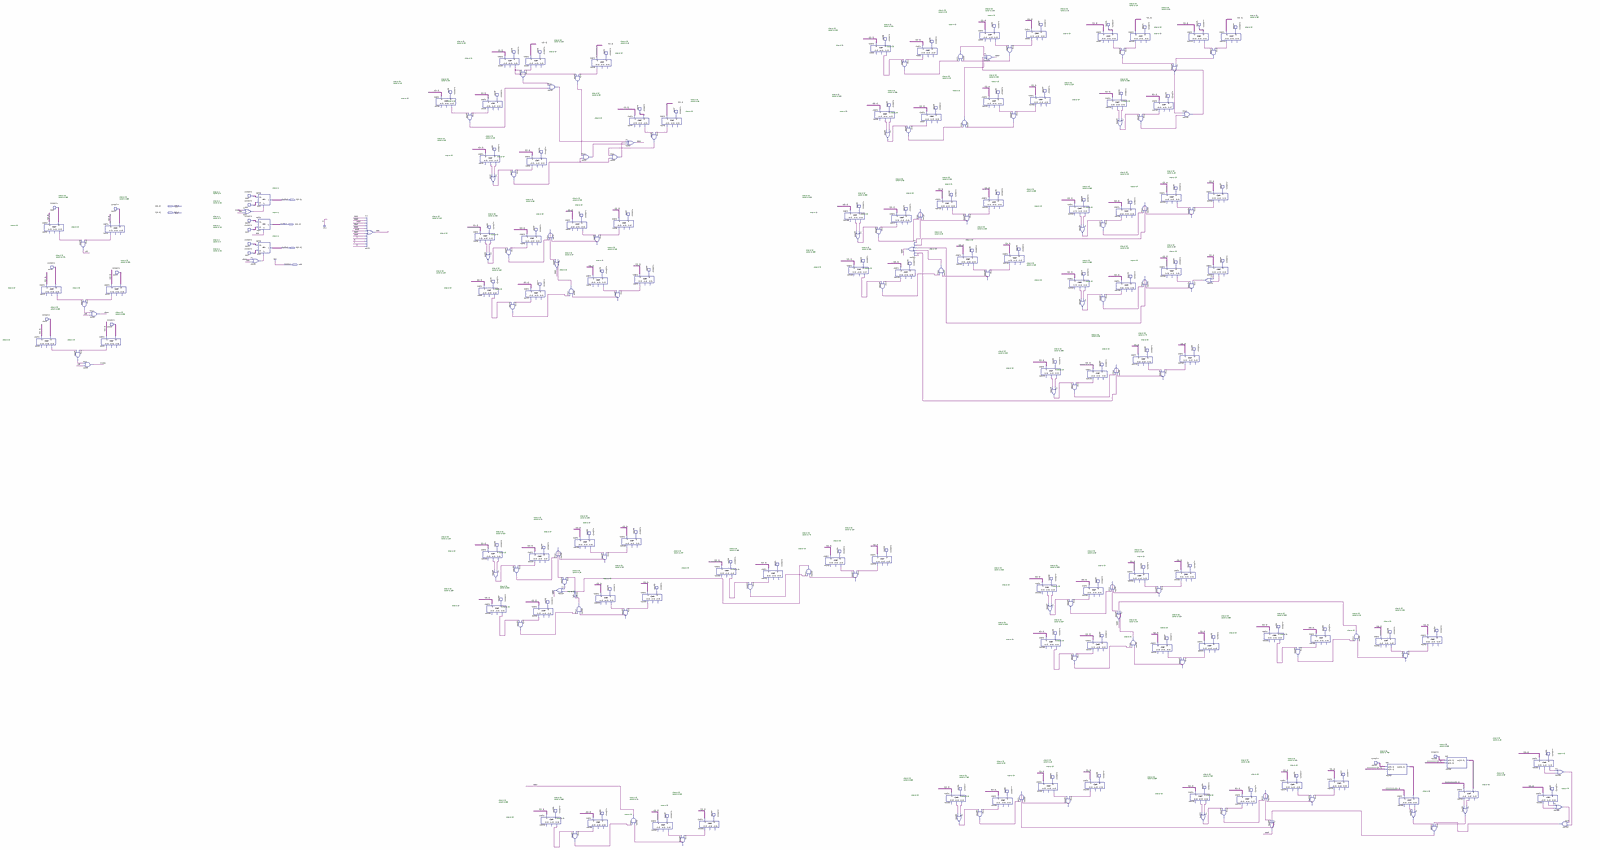
[diagram p0: schematic sheet, whole]
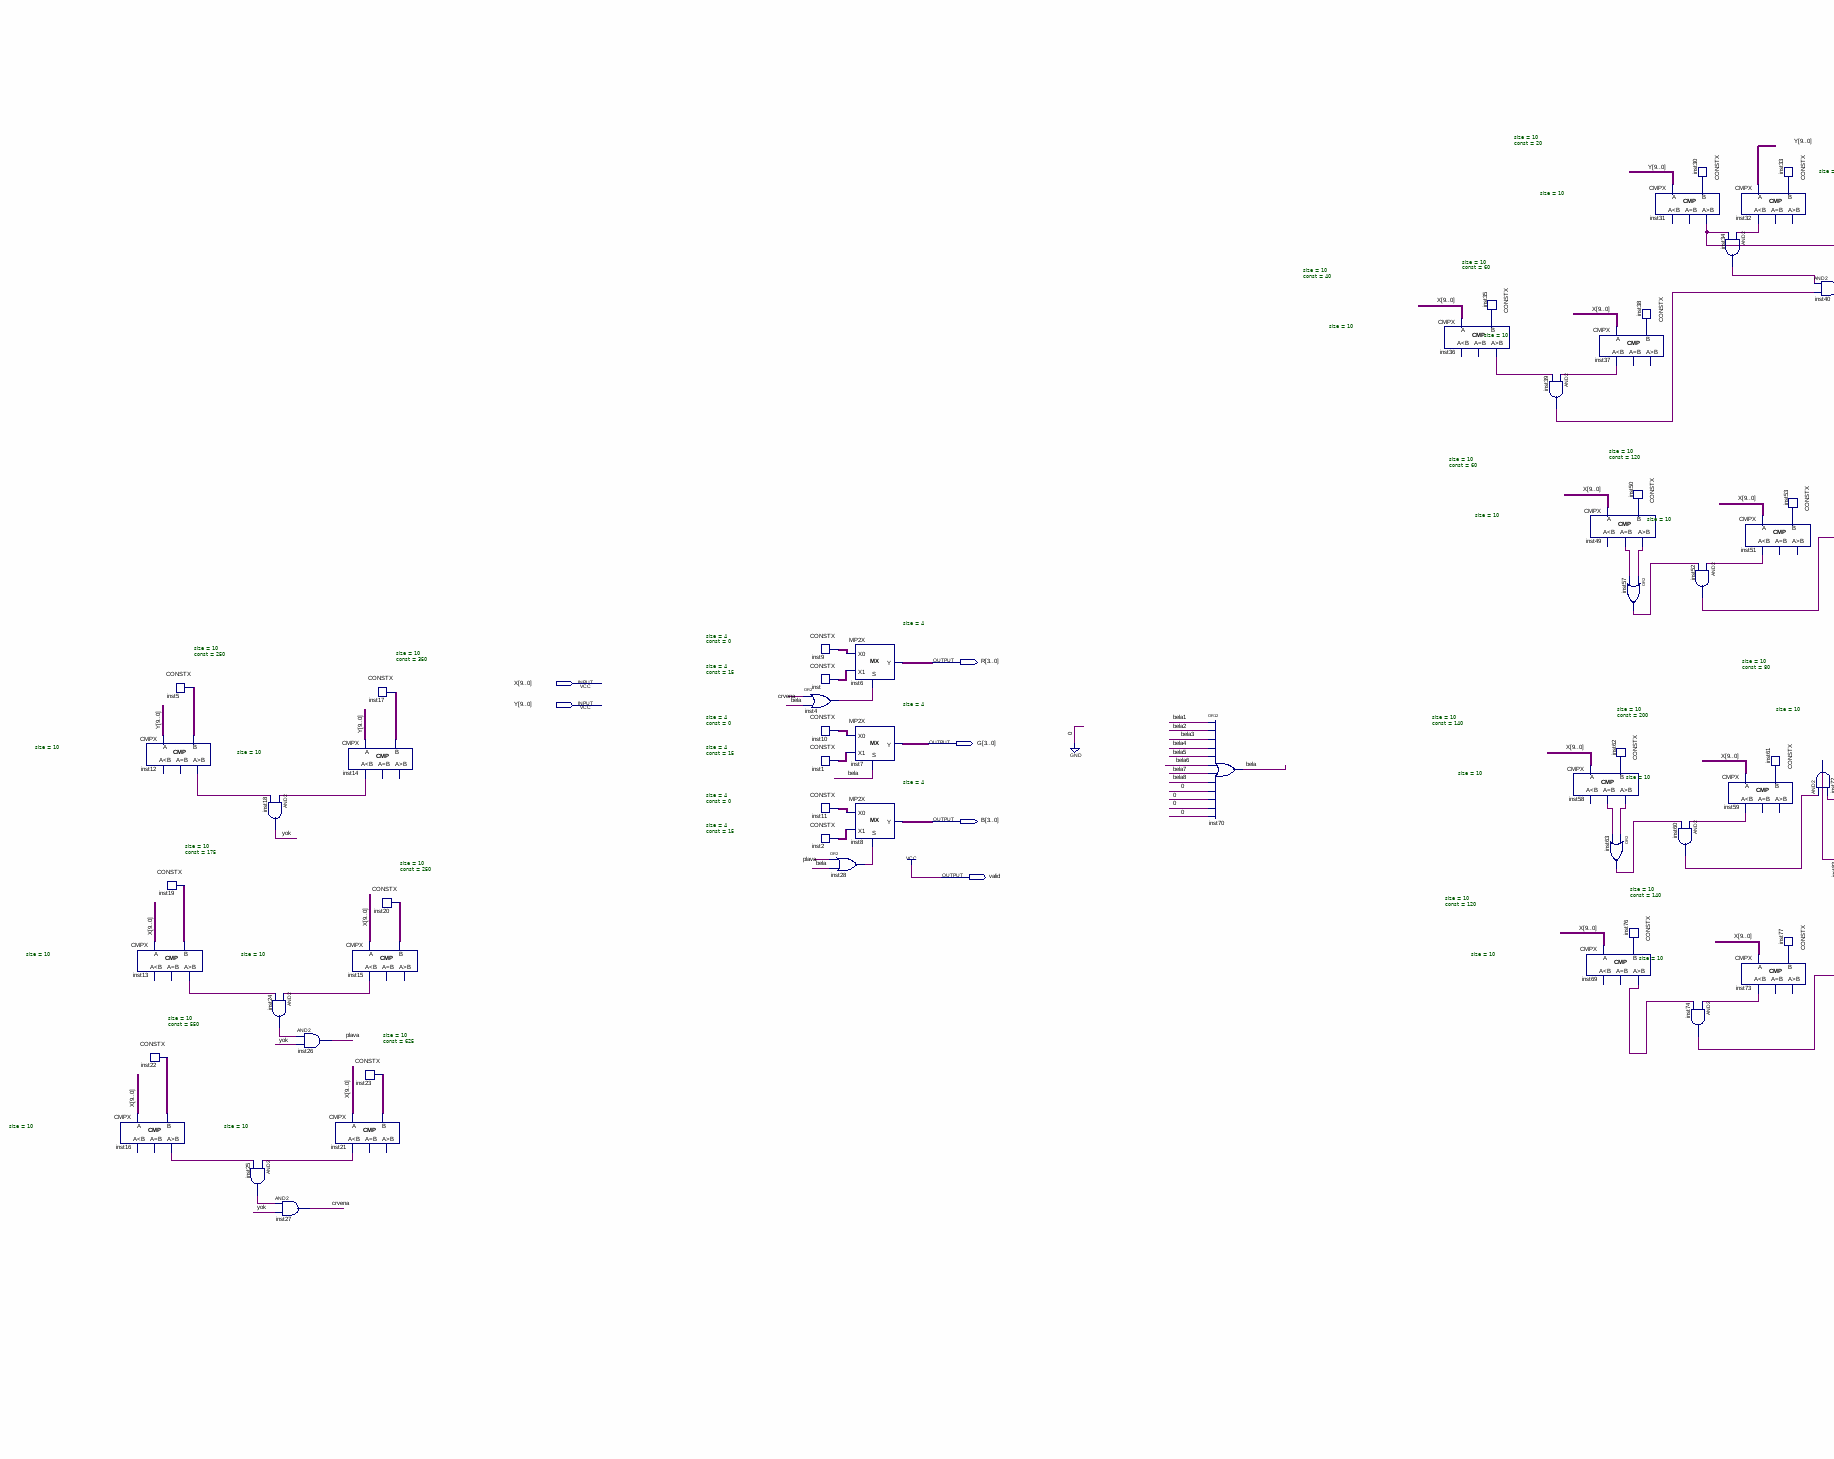
[diagram p1: schematic sheet, upper left part]
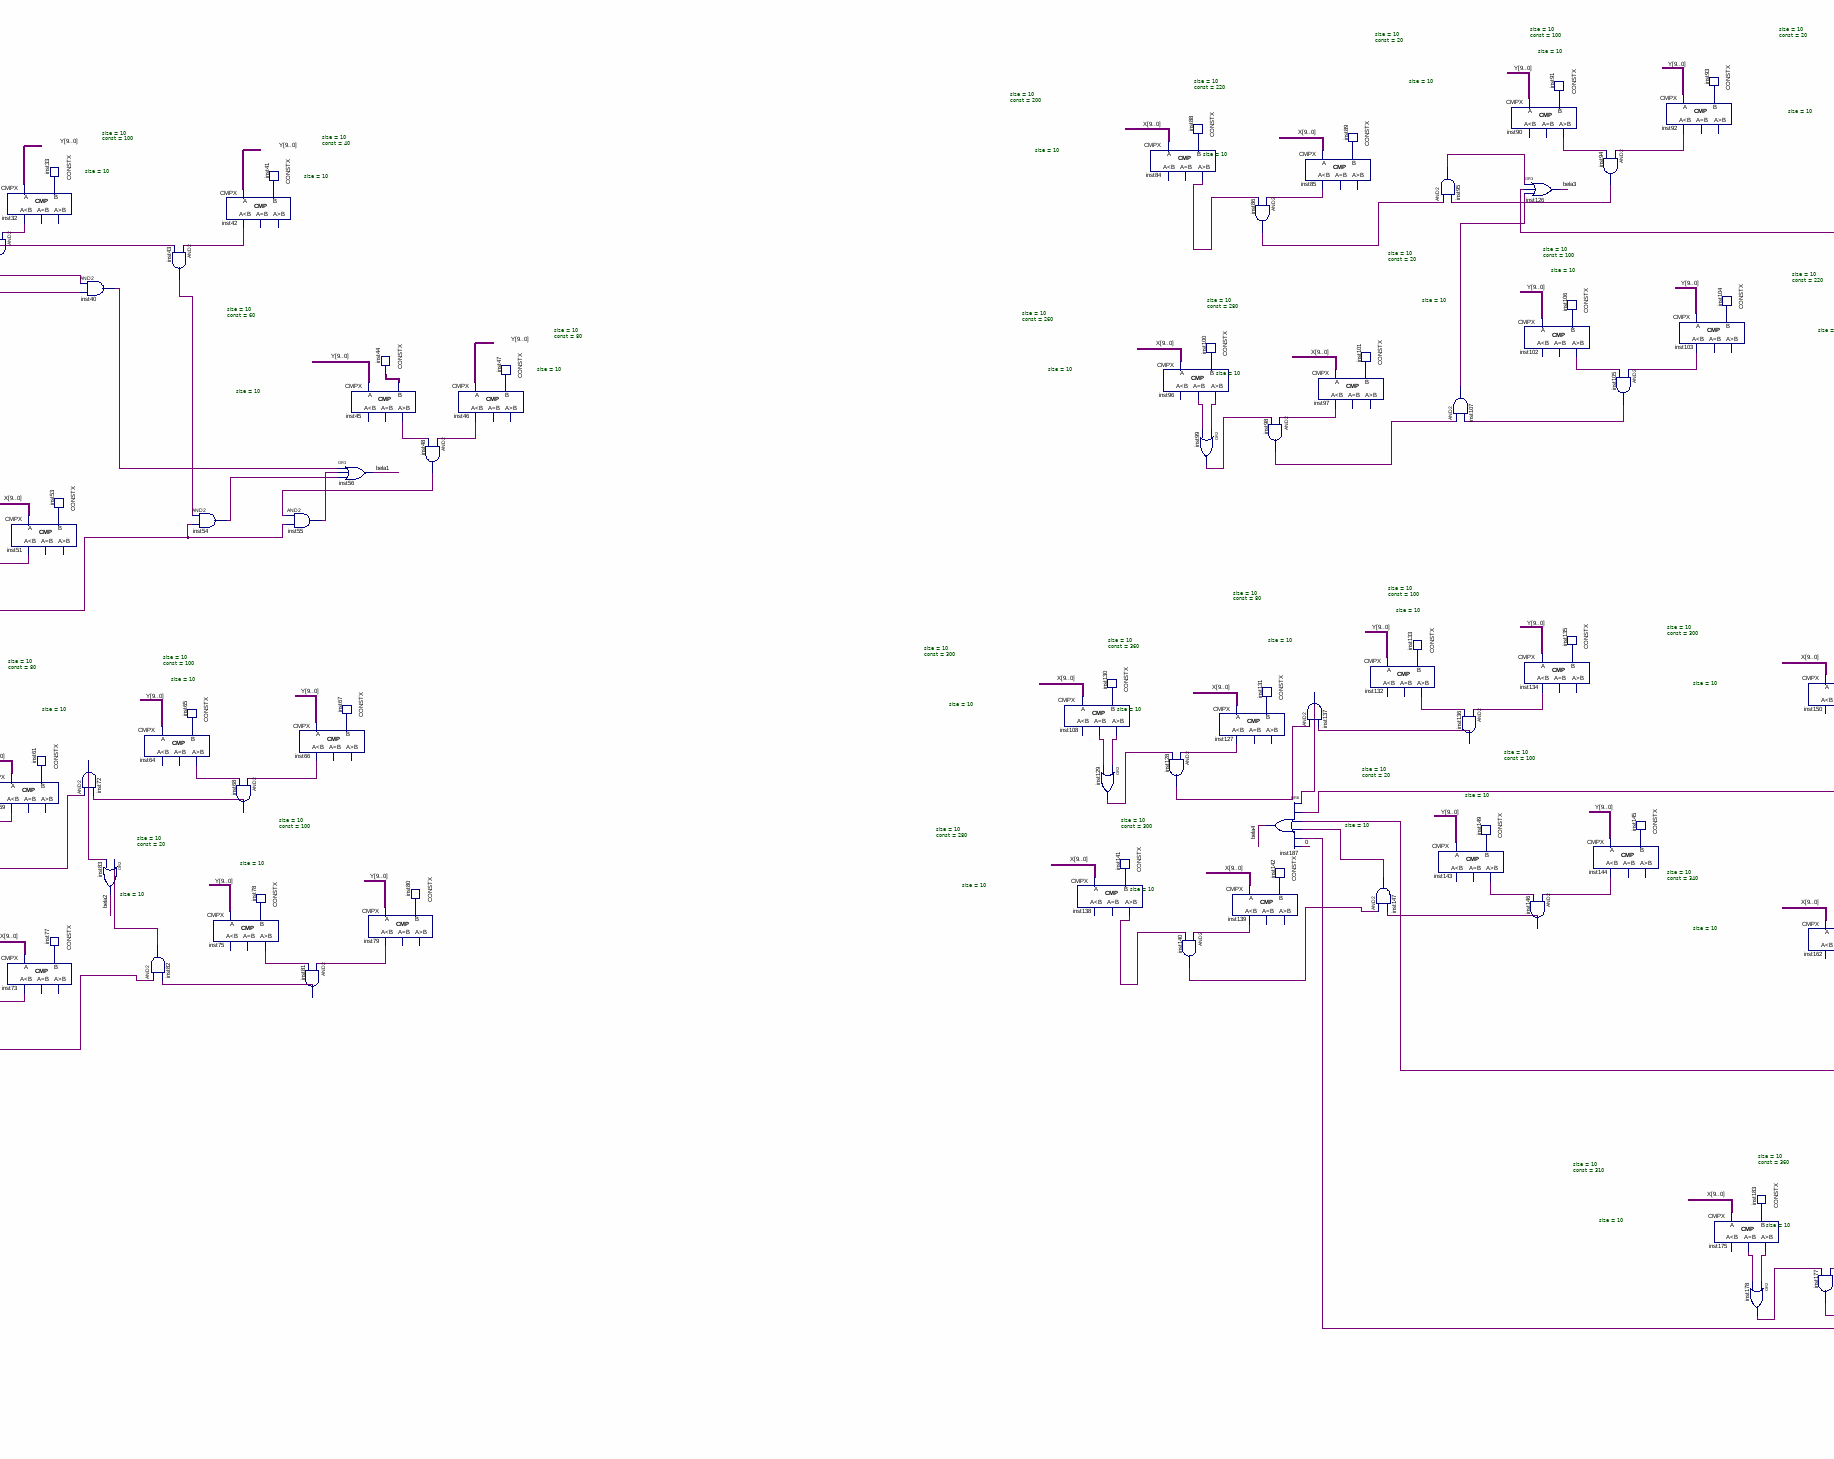
[diagram p2: schematic sheet, upper centre part]
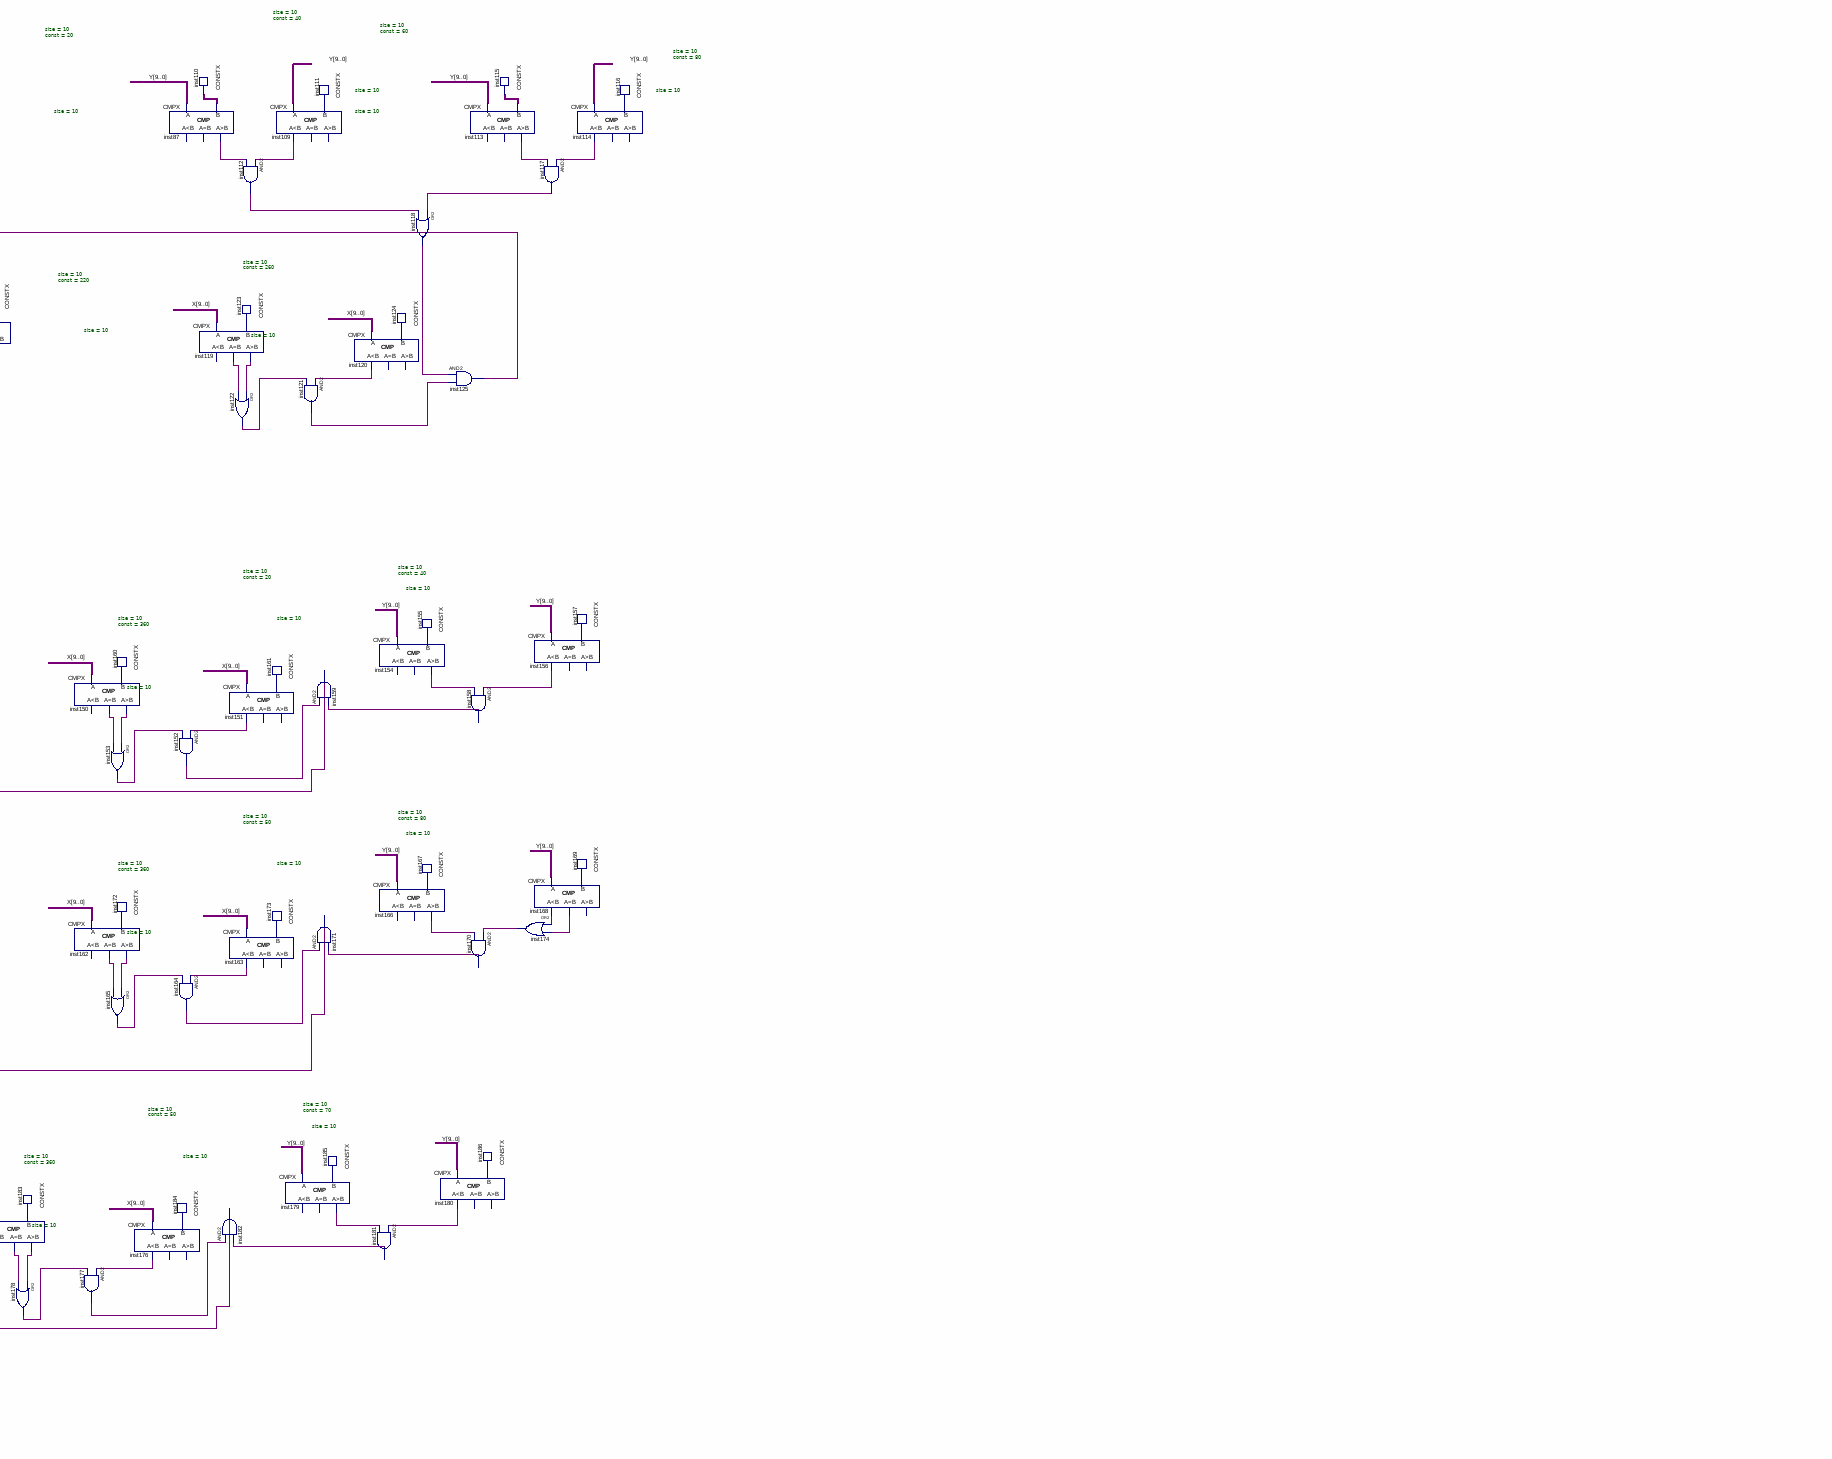
[diagram p3: schematic sheet, upper right part]
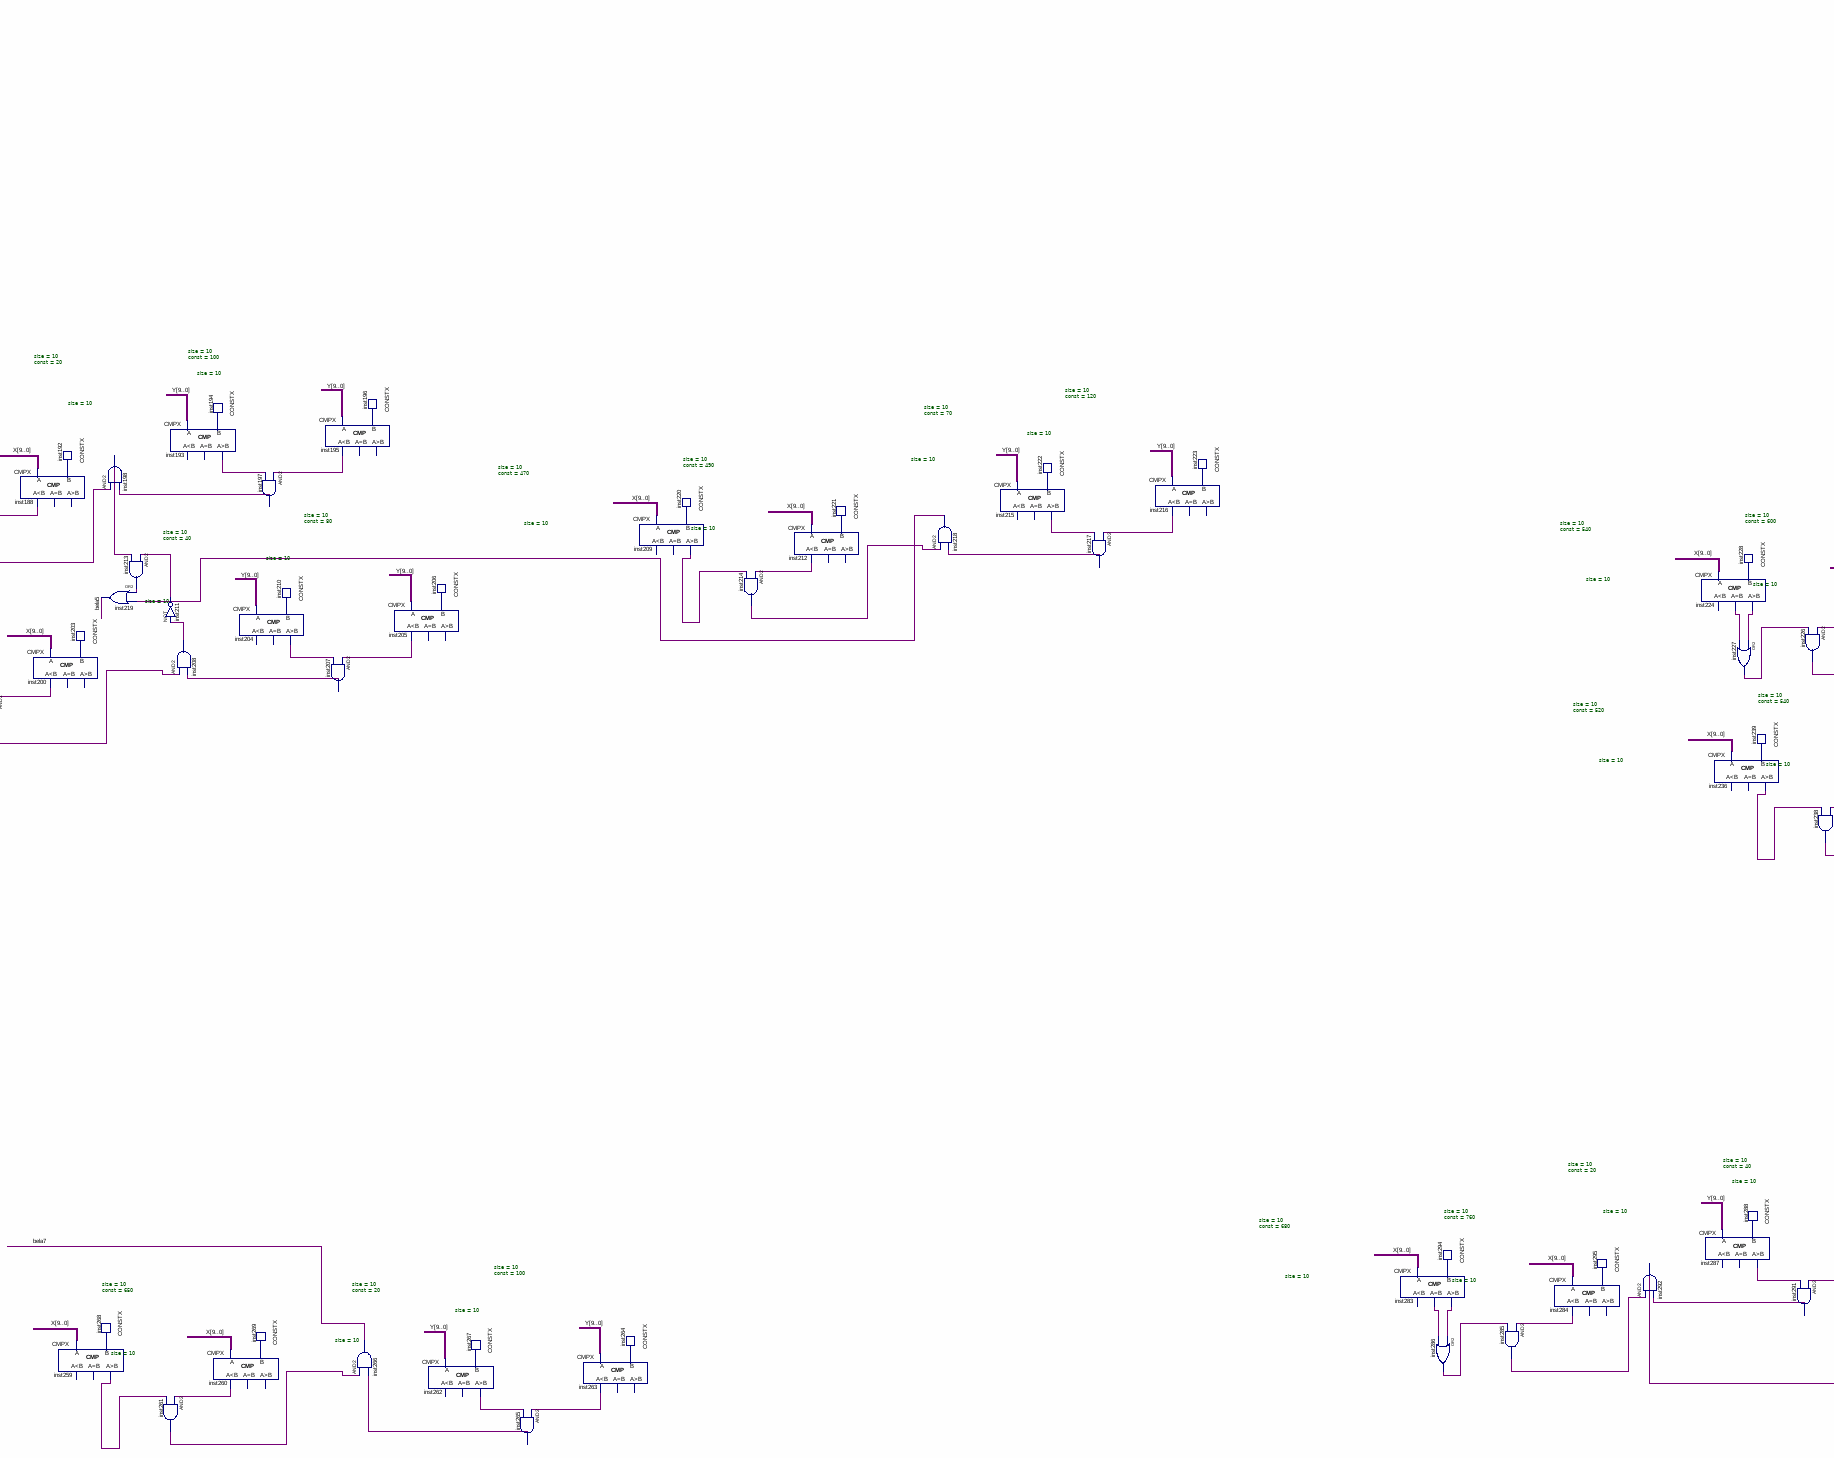
[diagram p4: schematic sheet, lower centre part]
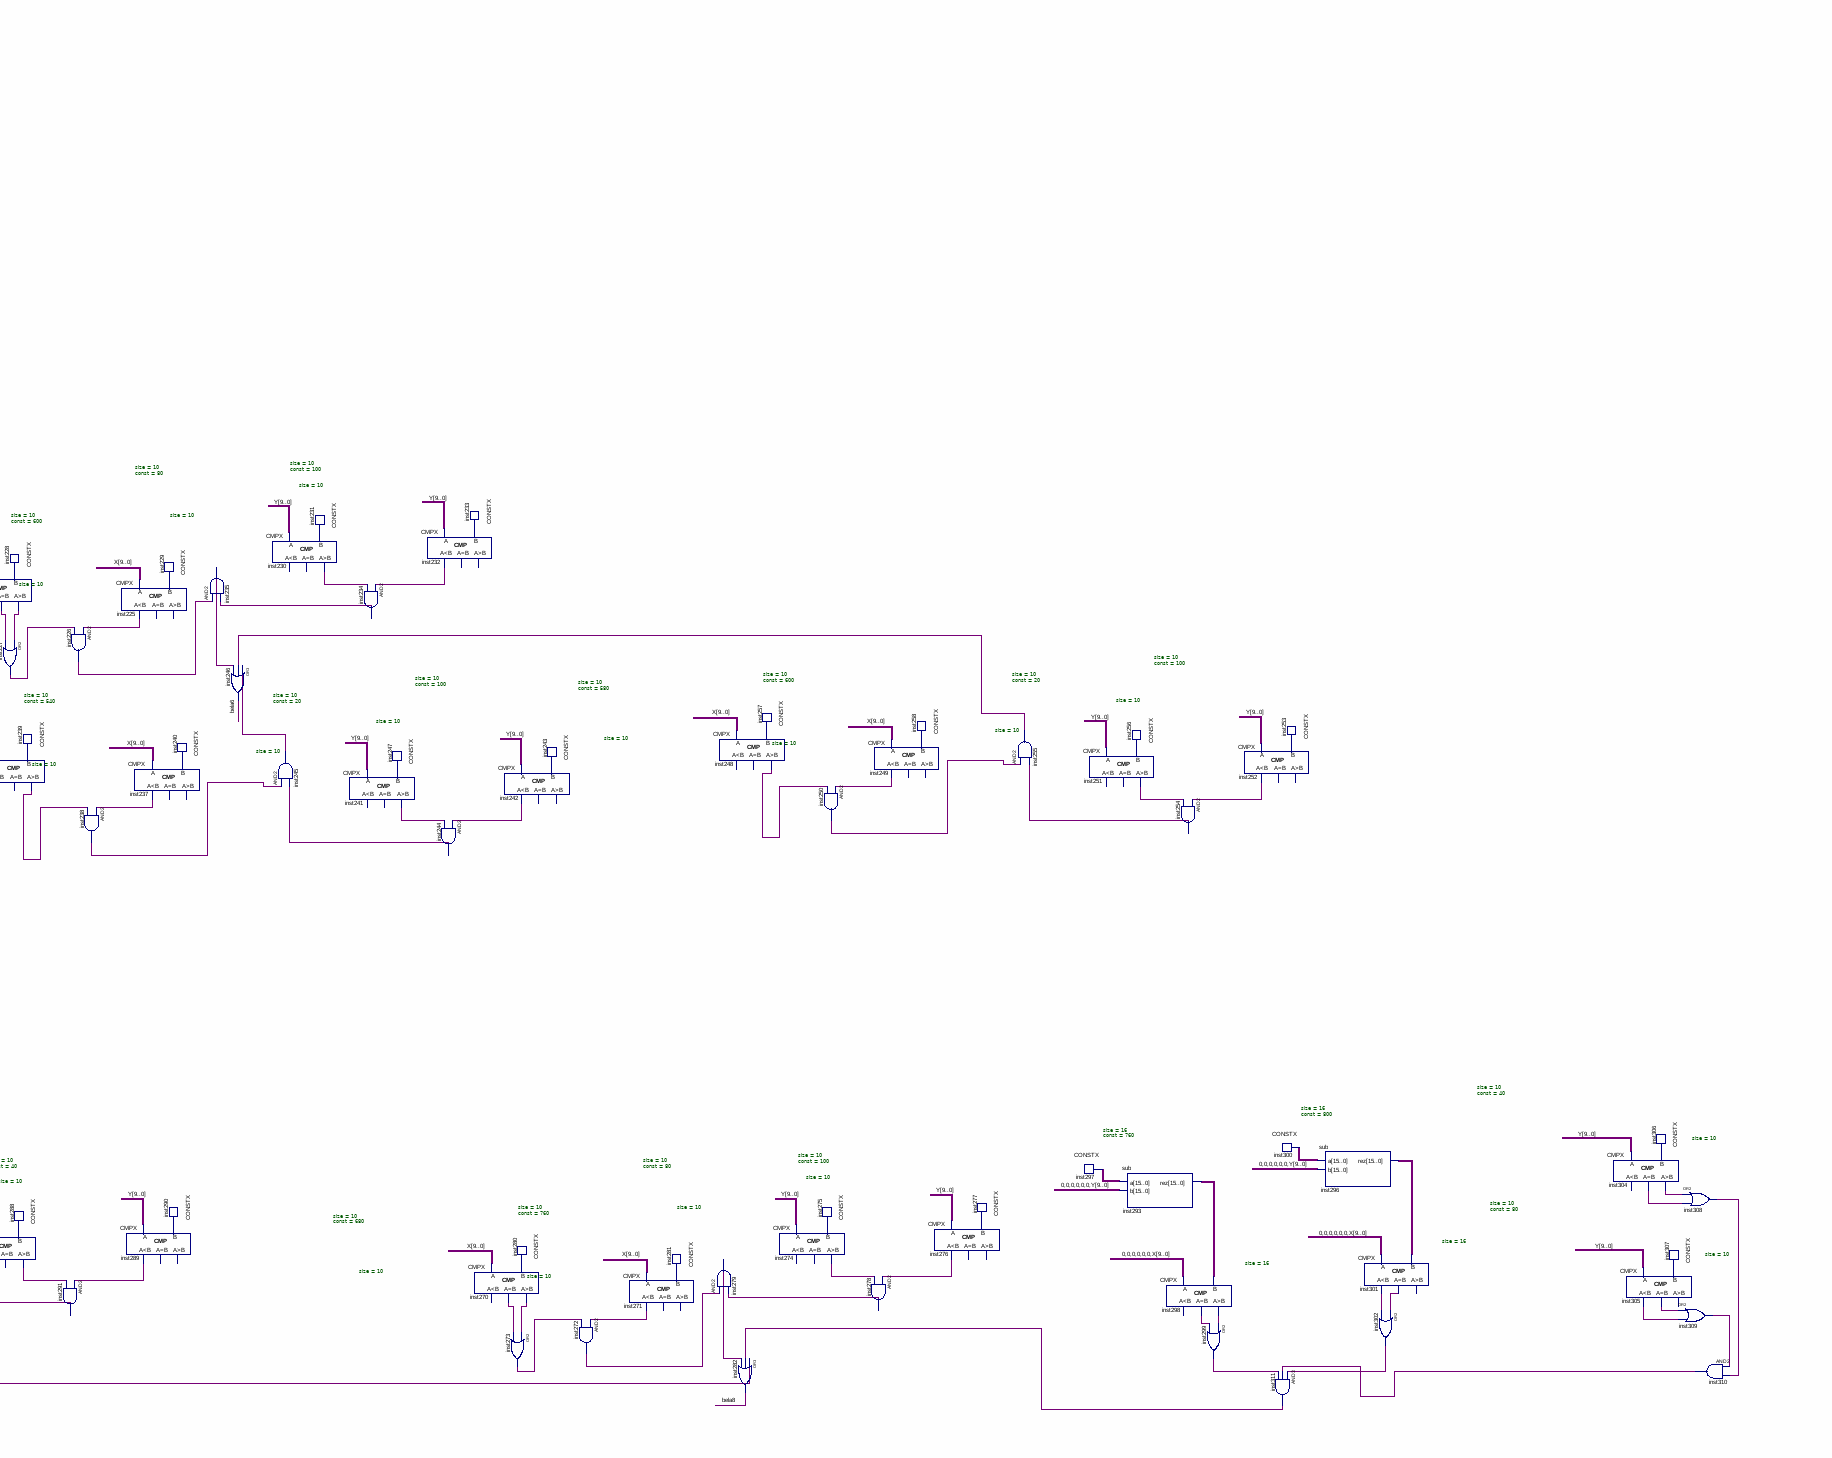
[diagram p5: schematic sheet, lower right part]
// Quartus schematic MainMenu.bdf as structural Verilog: 308 symbols, 6 pins
module MainMenu (
  input  [9:0] X,
  input  [9:0] Y,
  output [3:0] R,
  output [3:0] G,
  output [3:0] B,
  output valid
);

  wire bela, bela1, bela2, bela3, bela4, bela5, bela6, bela7, bela8, crvena, inst4_out, inst12_gr, inst13_gr,
       inst14_ls, inst15_ls, inst16_gr, inst21_ls, inst24_out, inst25_out, inst28_out, inst31_gr, inst32_ls,
       inst34_out, inst36_gr, inst37_ls, inst39_out, inst40_out, inst42_ls, inst43_out, inst45_gr, inst46_ls,
       inst48_out, inst49_eq, inst49_gr, inst51_ls, inst52_out, inst54_out, inst55_out, inst57_out,
       inst58_eq, inst58_gr, inst59_ls, inst60_out, inst63_out, inst64_gr, inst66_ls, inst68_out, inst69_gr,
       inst72_out, inst73_ls, inst74_out, inst75_gr, inst79_ls, inst81_out, inst82_out, inst84_gr, inst85_ls,
       inst86_out, inst87_gr, inst90_gr, inst92_ls, inst94_out, inst95_out, inst96_eq, inst96_gr, inst97_ls,
       inst98_out, inst99_out, inst102_gr, inst103_ls, inst105_out, inst107_out, inst108_eq, inst108_gr,
       inst109_ls, inst112_out, inst113_gr, inst114_ls, inst117_out, inst118_out, inst119_eq, inst119_gr,
       inst120_ls, inst121_out, inst122_out, inst125_out, inst127_ls, inst128_out, inst129_out, inst132_gr,
       inst134_ls, inst136_out, inst137_out, inst138_gr, inst139_ls, inst140_out, inst143_gr, inst144_ls,
       inst146_out, inst147_out, inst148_eq, inst148_gr, inst150_eq, inst150_gr, inst151_ls, inst152_out,
       inst153_out, inst154_gr, inst156_ls, inst158_out, inst159_out, inst162_eq, inst162_gr, inst163_ls,
       inst164_out, inst165_out, inst166_gr, inst168_eq, inst168_ls, inst170_out, inst171_out, inst174_out,
       inst175_eq, inst175_gr, inst176_ls, inst177_out, inst178_out, inst179_gr, inst180_ls, inst181_out,
       inst182_out, inst188_ls, inst189_out, inst190_out, inst193_gr, inst195_ls, inst197_out, inst198_out,
       inst199_gr, inst200_ls, inst201_out, inst204_gr, inst205_ls, inst207_out, inst208_out, inst209_gr,
       inst211_out, inst212_ls, inst213_out, inst214_out, inst215_gr, inst216_ls, inst217_out, inst218_out,
       inst224_eq, inst224_gr, inst225_ls, inst226_out, inst227_out, inst230_gr, inst232_ls, inst234_out,
       inst235_out, inst236_gr, inst237_ls, inst238_out, inst241_gr, inst242_ls, inst244_out, inst245_out,
       inst248_gr, inst249_ls, inst250_out, inst251_gr, inst252_ls, inst254_out, inst255_out, inst259_gr,
       inst260_ls, inst261_out, inst262_gr, inst263_ls, inst265_out, inst270_eq, inst270_gr, inst271_ls,
       inst272_out, inst273_out, inst274_gr, inst276_ls, inst278_out, inst279_out, inst283_eq, inst283_gr,
       inst284_ls, inst285_out, inst286_out, inst287_gr, inst289_ls, inst291_out, inst292_out, inst298_eq,
       inst298_gr, inst299_out, inst301_eq, inst301_ls, inst302_out, inst304_eq, inst304_gr, inst305_eq,
       inst305_ls, inst308_out, inst309_out, inst310_out, inst311_out, plava, yok;
  wire [3:0] inst1_data, inst2_data, inst9_data, inst10_data, inst11_data, inst_data;
  wire [9:0] inst5_data, inst17_data, inst19_data, inst20_data, inst22_data, inst23_data, inst30_data,
       inst33_data, inst35_data, inst38_data, inst41_data, inst44_data, inst47_data, inst50_data,
       inst53_data, inst61_data, inst62_data, inst65_data, inst67_data, inst76_data, inst77_data,
       inst78_data, inst80_data, inst88_data, inst89_data, inst91_data, inst93_data, inst100_data,
       inst101_data, inst104_data, inst106_data, inst110_data, inst111_data, inst115_data, inst116_data,
       inst123_data, inst124_data, inst130_data, inst131_data, inst133_data, inst135_data, inst141_data,
       inst142_data, inst145_data, inst149_data, inst155_data, inst157_data, inst160_data, inst161_data,
       inst167_data, inst169_data, inst172_data, inst173_data, inst183_data, inst184_data, inst185_data,
       inst186_data, inst191_data, inst192_data, inst194_data, inst196_data, inst202_data, inst203_data,
       inst206_data, inst210_data, inst220_data, inst221_data, inst222_data, inst223_data, inst228_data,
       inst229_data, inst231_data, inst233_data, inst239_data, inst240_data, inst243_data, inst247_data,
       inst253_data, inst256_data, inst257_data, inst258_data, inst264_data, inst267_data, inst268_data,
       inst269_data, inst275_data, inst277_data, inst280_data, inst281_data, inst288_data, inst290_data,
       inst294_data, inst295_data, inst306_data, inst307_data;
  wire [15:0] inst293_rez, inst296_rez, inst297_data, inst300_data;

  CMPX #(.size(10)) inst16 (.A(X), .B(inst22_data), .gr(inst16_gr));  // open: ls, eq
  CMPX #(.size(10)) inst12 (.A(Y), .B(inst5_data), .gr(inst12_gr));  // open: ls, eq
  CONSTX #(.size(10), .\const (175)) inst19 (.data(inst19_data));
  CMPX #(.size(10)) inst13 (.A(X), .B(inst19_data), .gr(inst13_gr));  // open: ls, eq
  CONSTX #(.size(10), .\const (550)) inst22 (.data(inst22_data));
  CONSTX #(.size(10), .\const (250)) inst5 (.data(inst5_data));
  and inst18 (yok, inst14_ls, inst12_gr);
  and inst25 (inst25_out, inst21_ls, inst16_gr);
  and inst24 (inst24_out, inst15_ls, inst13_gr);
  and inst26 (plava, inst24_out, yok);
  and inst27 (crvena, inst25_out, yok);
  CMPX #(.size(10)) inst21 (.A(X), .B(inst23_data), .ls(inst21_ls));  // open: eq, gr
  CONSTX #(.size(10), .\const (350)) inst17 (.data(inst17_data));
  CMPX #(.size(10)) inst14 (.A(Y), .B(inst17_data), .ls(inst14_ls));  // open: eq, gr
  CMPX #(.size(10)) inst15 (.A(X), .B(inst20_data), .ls(inst15_ls));  // open: eq, gr
  CONSTX #(.size(10), .\const (625)) inst23 (.data(inst23_data));
  CONSTX #(.size(10), .\const (250)) inst20 (.data(inst20_data));
  CONSTX #(.size(4), .\const (0)) inst9 (.data(inst9_data));
  CONSTX #(.size(4), .\const (15)) inst (.data(inst_data));
  or inst4 (inst4_out, crvena, bela);
  CONSTX #(.size(4), .\const (0)) inst10 (.data(inst10_data));
  CONSTX #(.size(4), .\const (15)) inst1 (.data(inst1_data));
  CONSTX #(.size(4), .\const (0)) inst11 (.data(inst11_data));
  CONSTX #(.size(4), .\const (15)) inst2 (.data(inst2_data));
  MP2X #(.size(4)) inst6 (.S(inst4_out), .X0(inst9_data), .X1(inst_data), .Y(R));
  MP2X #(.size(4)) inst7 (.S(bela), .X0(inst10_data), .X1(inst1_data), .Y(G));
  MP2X #(.size(4)) inst8 (.S(inst28_out), .X0(inst11_data), .X1(inst2_data), .Y(B));
  or inst28 (inst28_out, plava, bela);
  or inst70 (bela, bela1, bela2, bela3, bela4, bela5, bela6, bela7, bela8, 1'b0, 1'b0, 1'b0, 1'b0);
  CMPX #(.size(10)) inst36 (.A(X), .B(inst35_data), .gr(inst36_gr));  // open: ls, eq
  CONSTX #(.size(10), .\const (40)) inst35 (.data(inst35_data));
  and inst39 (inst39_out, inst37_ls, inst36_gr);
  CMPX #(.size(10)) inst58 (.A(X), .B(inst62_data), .eq(inst58_eq), .gr(inst58_gr));  // open: ls
  CMPX #(.size(10)) inst37 (.A(X), .B(inst38_data), .ls(inst37_ls));  // open: eq, gr
  CMPX #(.size(10)) inst49 (.A(X), .B(inst50_data), .eq(inst49_eq), .gr(inst49_gr));  // open: ls
  or inst63 (inst63_out, inst58_gr, inst58_eq);
  CMPX #(.size(10)) inst69 (.A(X), .B(inst76_data), .gr(inst69_gr));  // open: ls, eq
  CMPX #(.size(10)) inst148 (.A(X), .B(inst191_data), .eq(inst148_eq), .gr(inst148_gr));  // open: ls
  CMPX #(.size(10)) inst199 (.A(X), .B(inst202_data), .gr(inst199_gr));  // open: ls, eq
  CONSTX #(.size(10), .\const (60)) inst38 (.data(inst38_data));
  CONSTX #(.size(10), .\const (60)) inst50 (.data(inst50_data));
  or inst57 (inst57_out, inst49_gr, inst49_eq);
  CONSTX #(.size(10), .\const (140)) inst62 (.data(inst62_data));
  CONSTX #(.size(10), .\const (120)) inst76 (.data(inst76_data));
  CONSTX #(.size(10), .\const (440)) inst191 (.data(inst191_data));
  or inst190 (inst190_out, inst148_gr, inst148_eq);
  CMPX #(.size(10)) inst31 (.A(Y), .B(inst30_data), .gr(inst31_gr));  // open: ls, eq
  and inst60 (inst60_out, inst59_ls, inst63_out);
  CONSTX #(.size(10), .\const (460)) inst202 (.data(inst202_data));
  CONSTX #(.size(10), .\const (20)) inst30 (.data(inst30_data));
  and inst52 (inst52_out, inst51_ls, inst57_out);
  and inst74 (inst74_out, inst73_ls, inst69_gr);
  and inst189 (inst189_out, inst188_ls, inst190_out);
  CMPX #(.size(10)) inst32 (.A(Y), .B(inst33_data), .ls(inst32_ls));  // open: eq, gr
  and inst34 (inst34_out, inst32_ls, inst31_gr);
  CMPX #(.size(10)) inst51 (.A(X), .B(inst53_data), .ls(inst51_ls));  // open: eq, gr
  CMPX #(.size(10)) inst59 (.A(X), .B(inst61_data), .ls(inst59_ls));  // open: eq, gr
  CMPX #(.size(10)) inst73 (.A(X), .B(inst77_data), .ls(inst73_ls));  // open: eq, gr
  and inst201 (inst201_out, inst200_ls, inst199_gr);
  CONSTX #(.size(10), .\const (100)) inst33 (.data(inst33_data));
  CONSTX #(.size(10), .\const (200)) inst61 (.data(inst61_data));
  CONSTX #(.size(10), .\const (140)) inst77 (.data(inst77_data));
  CMPX #(.size(10)) inst188 (.A(X), .B(inst192_data), .ls(inst188_ls));  // open: eq, gr
  CMPX #(.size(10)) inst200 (.A(X), .B(inst203_data), .ls(inst200_ls));  // open: eq, gr
  CONSTX #(.size(10), .\const (120)) inst53 (.data(inst53_data));
  and inst72 (inst72_out, inst60_out, inst68_out);
  CONSTX #(.size(10), .\const (520)) inst192 (.data(inst192_data));
  CONSTX #(.size(10), .\const (500)) inst203 (.data(inst203_data));
  CMPX #(.size(10)) inst259 (.A(X), .B(inst268_data), .gr(inst259_gr));  // open: ls, eq
  and inst40 (inst40_out, inst34_out, inst39_out);
  or inst83 (bela2, inst82_out, inst72_out);
  and inst198 (inst198_out, inst189_out, inst197_out);
  or inst219 (bela5, inst213_out, inst218_out);
  CONSTX #(.size(10), .\const (630)) inst268 (.data(inst268_data));
  CMPX #(.size(10)) inst64 (.A(Y), .B(inst65_data), .gr(inst64_gr));  // open: ls, eq
  and inst82 (inst82_out, inst74_out, inst81_out);
  and inst213 (inst213_out, inst211_out, inst198_out);
  and inst43 (inst43_out, inst42_ls, inst31_gr);
  CONSTX #(.size(10), .\const (80)) inst65 (.data(inst65_data));
  CMPX #(.size(10)) inst193 (.A(Y), .B(inst194_data), .gr(inst193_gr));  // open: ls, eq
  not inst211 (inst211_out, inst208_out);
  and inst208 (inst208_out, inst201_out, inst207_out);
  and inst261 (inst261_out, inst260_ls, inst259_gr);
  and inst54 (inst54_out, inst43_out, inst52_out);
  CMPX #(.size(10)) inst75 (.A(Y), .B(inst78_data), .gr(inst75_gr));  // open: ls, eq
  CONSTX #(.size(10), .\const (20)) inst194 (.data(inst194_data));
  CMPX #(.size(10)) inst260 (.A(X), .B(inst269_data), .ls(inst260_ls));  // open: eq, gr
  CMPX #(.size(10)) inst42 (.A(Y), .B(inst41_data), .ls(inst42_ls));  // open: eq, gr
  and inst68 (inst68_out, inst66_ls, inst64_gr);
  CONSTX #(.size(10), .\const (20)) inst78 (.data(inst78_data));
  CMPX #(.size(10)) inst204 (.A(Y), .B(inst210_data), .gr(inst204_gr));  // open: ls, eq
  CONSTX #(.size(10), .\const (650)) inst269 (.data(inst269_data));
  CONSTX #(.size(10), .\const (40)) inst41 (.data(inst41_data));
  and inst197 (inst197_out, inst195_ls, inst193_gr);
  CONSTX #(.size(10), .\const (40)) inst210 (.data(inst210_data));
  and inst55 (inst55_out, inst48_out, inst52_out);
  CMPX #(.size(10)) inst66 (.A(Y), .B(inst67_data), .ls(inst66_ls));  // open: eq, gr
  and inst81 (inst81_out, inst79_ls, inst75_gr);
  CMPX #(.size(10)) inst195 (.A(Y), .B(inst196_data), .ls(inst195_ls));  // open: eq, gr
  CMPX #(.size(10)) inst45 (.A(Y), .B(inst44_data), .gr(inst45_gr));  // open: ls, eq
  or inst56 (bela1, inst40_out, inst55_out, inst54_out);
  CONSTX #(.size(10), .\const (100)) inst67 (.data(inst67_data));
  and inst207 (inst207_out, inst205_ls, inst204_gr);
  and inst266 (bela7, inst261_out, inst265_out);
  CONSTX #(.size(10), .\const (60)) inst44 (.data(inst44_data));
  CMPX #(.size(10)) inst79 (.A(Y), .B(inst80_data), .ls(inst79_ls));  // open: eq, gr
  CONSTX #(.size(10), .\const (100)) inst196 (.data(inst196_data));
  CMPX #(.size(10)) inst205 (.A(Y), .B(inst206_data), .ls(inst205_ls));  // open: eq, gr
  and inst48 (inst48_out, inst46_ls, inst45_gr);
  CONSTX #(.size(10), .\const (100)) inst80 (.data(inst80_data));
  CMPX #(.size(10)) inst262 (.A(Y), .B(inst267_data), .gr(inst262_gr));  // open: ls, eq
  CMPX #(.size(10)) inst46 (.A(Y), .B(inst47_data), .ls(inst46_ls));  // open: eq, gr
  CONSTX #(.size(10), .\const (80)) inst206 (.data(inst206_data));
  CONSTX #(.size(10), .\const (20)) inst267 (.data(inst267_data));
  CONSTX #(.size(10), .\const (80)) inst47 (.data(inst47_data));
  and inst265 (inst265_out, inst263_ls, inst262_gr);
  CMPX #(.size(10)) inst263 (.A(Y), .B(inst264_data), .ls(inst263_ls));  // open: eq, gr
  CONSTX #(.size(10), .\const (100)) inst264 (.data(inst264_data));
  CMPX #(.size(10)) inst209 (.A(X), .B(inst220_data), .gr(inst209_gr));  // open: ls, eq
  CONSTX #(.size(10), .\const (470)) inst220 (.data(inst220_data));
  and inst214 (inst214_out, inst212_ls, inst209_gr);
  CMPX #(.size(10)) inst212 (.A(X), .B(inst221_data), .ls(inst212_ls));  // open: eq, gr
  CONSTX #(.size(10), .\const (490)) inst221 (.data(inst221_data));
  and inst218 (inst218_out, inst214_out, inst217_out);
  CMPX #(.size(10)) inst215 (.A(Y), .B(inst222_data), .gr(inst215_gr));  // open: ls, eq
  CONSTX #(.size(10), .\const (70)) inst222 (.data(inst222_data));
  CMPX #(.size(10)) inst108 (.A(X), .B(inst130_data), .eq(inst108_eq), .gr(inst108_gr));  // open: ls
  CMPX #(.size(10)) inst138 (.A(X), .B(inst141_data), .gr(inst138_gr));  // open: ls, eq
  CONSTX #(.size(10), .\const (300)) inst130 (.data(inst130_data));
  or inst129 (inst129_out, inst108_gr, inst108_eq);
  and inst217 (inst217_out, inst216_ls, inst215_gr);
  CMPX #(.size(10)) inst84 (.A(X), .B(inst88_data), .gr(inst84_gr));  // open: ls, eq
  CONSTX #(.size(10), .\const (280)) inst141 (.data(inst141_data));
  CMPX #(.size(10)) inst96 (.A(X), .B(inst100_data), .eq(inst96_eq), .gr(inst96_gr));  // open: ls
  and inst128 (inst128_out, inst127_ls, inst129_out);
  and inst140 (inst140_out, inst139_ls, inst138_gr);
  CMPX #(.size(10)) inst216 (.A(Y), .B(inst223_data), .ls(inst216_ls));  // open: eq, gr
  CONSTX #(.size(10), .\const (200)) inst88 (.data(inst88_data));
  CONSTX #(.size(10), .\const (260)) inst100 (.data(inst100_data));
  or inst99 (inst99_out, inst96_gr, inst96_eq);
  CMPX #(.size(10)) inst127 (.A(X), .B(inst131_data), .ls(inst127_ls));  // open: eq, gr
  CONSTX #(.size(10), .\const (120)) inst223 (.data(inst223_data));
  CMPX #(.size(10)) inst139 (.A(X), .B(inst142_data), .ls(inst139_ls));  // open: eq, gr
  and inst86 (inst86_out, inst85_ls, inst84_gr);
  and inst98 (inst98_out, inst97_ls, inst99_out);
  CONSTX #(.size(10), .\const (360)) inst131 (.data(inst131_data));
  or inst187 (bela4, inst137_out, inst159_out, inst171_out, inst147_out, inst182_out, 1'b0);
  CONSTX #(.size(10), .\const (300)) inst142 (.data(inst142_data));
  CMPX #(.size(10)) inst85 (.A(X), .B(inst89_data), .ls(inst85_ls));  // open: eq, gr
  CMPX #(.size(10)) inst97 (.A(X), .B(inst101_data), .ls(inst97_ls));  // open: eq, gr
  and inst137 (inst137_out, inst128_out, inst136_out);
  CONSTX #(.size(10), .\const (220)) inst89 (.data(inst89_data));
  CONSTX #(.size(10), .\const (280)) inst101 (.data(inst101_data));
  CMPX #(.size(10)) inst132 (.A(Y), .B(inst133_data), .gr(inst132_gr));  // open: ls, eq
  and inst147 (inst147_out, inst140_out, inst146_out);
  CONSTX #(.size(10), .\const (80)) inst133 (.data(inst133_data));
  CMPX #(.size(10)) inst283 (.A(X), .B(inst294_data), .eq(inst283_eq), .gr(inst283_gr));  // open: ls
  and inst95 (inst95_out, inst86_out, inst94_out);
  and inst107 (inst107_out, inst98_out, inst105_out);
  CMPX #(.size(10)) inst143 (.A(Y), .B(inst149_data), .gr(inst143_gr));  // open: ls, eq
  CONSTX #(.size(10), .\const (680)) inst294 (.data(inst294_data));
  or inst286 (inst286_out, inst283_gr, inst283_eq);
  and inst136 (inst136_out, inst134_ls, inst132_gr);
  CONSTX #(.size(10), .\const (20)) inst149 (.data(inst149_data));
  CMPX #(.size(10)) inst90 (.A(Y), .B(inst91_data), .gr(inst90_gr));  // open: ls, eq
  CMPX #(.size(10)) inst102 (.A(Y), .B(inst106_data), .gr(inst102_gr));  // open: ls, eq
  CMPX #(.size(10)) inst134 (.A(Y), .B(inst135_data), .ls(inst134_ls));  // open: eq, gr
  and inst285 (inst285_out, inst284_ls, inst286_out);
  CONSTX #(.size(10), .\const (20)) inst91 (.data(inst91_data));
  or inst126 (bela3, inst95_out, inst125_out, inst107_out);
  and inst146 (inst146_out, inst144_ls, inst143_gr);
  CMPX #(.size(10)) inst284 (.A(X), .B(inst295_data), .ls(inst284_ls));  // open: eq, gr
  CONSTX #(.size(10), .\const (20)) inst106 (.data(inst106_data));
  CONSTX #(.size(10), .\const (100)) inst135 (.data(inst135_data));
  CMPX #(.size(10)) inst144 (.A(Y), .B(inst145_data), .ls(inst144_ls));  // open: eq, gr
  CONSTX #(.size(10), .\const (760)) inst295 (.data(inst295_data));
  and inst94 (inst94_out, inst92_ls, inst90_gr);
  and inst105 (inst105_out, inst103_ls, inst102_gr);
  CMPX #(.size(10)) inst92 (.A(Y), .B(inst93_data), .ls(inst92_ls));  // open: eq, gr
  CONSTX #(.size(10), .\const (100)) inst145 (.data(inst145_data));
  and inst292 (inst292_out, inst285_out, inst291_out);
  CMPX #(.size(10)) inst103 (.A(Y), .B(inst104_data), .ls(inst103_ls));  // open: eq, gr
  CMPX #(.size(10)) inst224 (.A(X), .B(inst228_data), .eq(inst224_eq), .gr(inst224_gr));  // open: ls
  CONSTX #(.size(10), .\const (100)) inst93 (.data(inst93_data));
  CONSTX #(.size(10), .\const (100)) inst104 (.data(inst104_data));
  CMPX #(.size(10)) inst175 (.A(X), .B(inst183_data), .eq(inst175_eq), .gr(inst175_gr));  // open: ls
  CMPX #(.size(10)) inst236 (.A(X), .B(inst239_data), .gr(inst236_gr));  // open: ls, eq
  CMPX #(.size(10)) inst287 (.A(Y), .B(inst288_data), .gr(inst287_gr));  // open: ls, eq
  CONSTX #(.size(10), .\const (310)) inst183 (.data(inst183_data));
  or inst178 (inst178_out, inst175_gr, inst175_eq);
  CONSTX #(.size(10), .\const (540)) inst228 (.data(inst228_data));
  or inst227 (inst227_out, inst224_gr, inst224_eq);
  CONSTX #(.size(10), .\const (520)) inst239 (.data(inst239_data));
  CONSTX #(.size(10), .\const (20)) inst288 (.data(inst288_data));
  and inst291 (inst291_out, inst289_ls, inst287_gr);
  CMPX #(.size(10)) inst150 (.A(X), .B(inst160_data), .eq(inst150_eq), .gr(inst150_gr));  // open: ls
  CMPX #(.size(10)) inst162 (.A(X), .B(inst172_data), .eq(inst162_eq), .gr(inst162_gr));  // open: ls
  and inst177 (inst177_out, inst176_ls, inst178_out);
  and inst226 (inst226_out, inst225_ls, inst227_out);
  and inst238 (inst238_out, inst237_ls, inst236_gr);
  CONSTX #(.size(10), .\const (300)) inst160 (.data(inst160_data));
  or inst153 (inst153_out, inst150_gr, inst150_eq);
  CONSTX #(.size(10), .\const (340)) inst172 (.data(inst172_data));
  or inst165 (inst165_out, inst162_gr, inst162_eq);
  CMPX #(.size(10)) inst176 (.A(X), .B(inst184_data), .ls(inst176_ls));  // open: eq, gr
  CMPX #(.size(10)) inst225 (.A(X), .B(inst229_data), .ls(inst225_ls));  // open: eq, gr
  CMPX #(.size(10)) inst237 (.A(X), .B(inst240_data), .ls(inst237_ls));  // open: eq, gr
  CMPX #(.size(10)) inst289 (.A(Y), .B(inst290_data), .ls(inst289_ls));  // open: eq, gr
  CMPX #(.size(10)) inst87 (.A(Y), .B(inst110_data), .gr(inst87_gr));  // open: ls, eq
  CONSTX #(.size(10), .\const (600)) inst229 (.data(inst229_data));
  CONSTX #(.size(10), .\const (40)) inst290 (.data(inst290_data));
  CONSTX #(.size(10), .\const (20)) inst110 (.data(inst110_data));
  CMPX #(.size(10)) inst119 (.A(X), .B(inst123_data), .eq(inst119_eq), .gr(inst119_gr));  // open: ls
  and inst152 (inst152_out, inst151_ls, inst153_out);
  and inst164 (inst164_out, inst163_ls, inst165_out);
  CONSTX #(.size(10), .\const (360)) inst184 (.data(inst184_data));
  CONSTX #(.size(10), .\const (540)) inst240 (.data(inst240_data));
  CONSTX #(.size(10), .\const (220)) inst123 (.data(inst123_data));
  or inst122 (inst122_out, inst119_gr, inst119_eq);
  CMPX #(.size(10)) inst151 (.A(X), .B(inst161_data), .ls(inst151_ls));  // open: eq, gr
  CMPX #(.size(10)) inst163 (.A(X), .B(inst173_data), .ls(inst163_ls));  // open: eq, gr
  and inst182 (inst182_out, inst177_out, inst181_out);
  and inst235 (inst235_out, inst226_out, inst234_out);
  or inst246 (bela6, inst245_out, inst255_out, inst235_out);
  CMPX #(.size(10)) inst109 (.A(Y), .B(inst111_data), .ls(inst109_ls));  // open: eq, gr
  and inst112 (inst112_out, inst109_ls, inst87_gr);
  CONSTX #(.size(10), .\const (360)) inst161 (.data(inst161_data));
  CONSTX #(.size(10), .\const (360)) inst173 (.data(inst173_data));
  CMPX #(.size(10)) inst230 (.A(Y), .B(inst231_data), .gr(inst230_gr));  // open: ls, eq
  and inst121 (inst121_out, inst120_ls, inst122_out);
  CMPX #(.size(10)) inst179 (.A(Y), .B(inst185_data), .gr(inst179_gr));  // open: ls, eq
  and inst245 (inst245_out, inst238_out, inst244_out);
  CONSTX #(.size(10), .\const (40)) inst111 (.data(inst111_data));
  and inst159 (inst159_out, inst152_out, inst158_out);
  and inst171 (inst171_out, inst164_out, inst170_out);
  CONSTX #(.size(10), .\const (50)) inst185 (.data(inst185_data));
  CONSTX #(.size(10), .\const (80)) inst231 (.data(inst231_data));
  CMPX #(.size(10)) inst120 (.A(X), .B(inst124_data), .ls(inst120_ls));  // open: eq, gr
  CMPX #(.size(10)) inst154 (.A(Y), .B(inst155_data), .gr(inst154_gr));  // open: ls, eq
  CMPX #(.size(10)) inst166 (.A(Y), .B(inst167_data), .gr(inst166_gr));  // open: ls, eq
  and inst181 (inst181_out, inst180_ls, inst179_gr);
  and inst234 (inst234_out, inst232_ls, inst230_gr);
  CMPX #(.size(10)) inst241 (.A(Y), .B(inst247_data), .gr(inst241_gr));  // open: ls, eq
  CONSTX #(.size(10), .\const (260)) inst124 (.data(inst124_data));
  CONSTX #(.size(10), .\const (20)) inst247 (.data(inst247_data));
  or inst118 (inst118_out, inst117_out, inst112_out);
  CONSTX #(.size(10), .\const (20)) inst155 (.data(inst155_data));
  CONSTX #(.size(10), .\const (50)) inst167 (.data(inst167_data));
  CMPX #(.size(10)) inst180 (.A(Y), .B(inst186_data), .ls(inst180_ls));  // open: eq, gr
  CMPX #(.size(10)) inst232 (.A(Y), .B(inst233_data), .ls(inst232_ls));  // open: eq, gr
  and inst244 (inst244_out, inst242_ls, inst241_gr);
  CMPX #(.size(10)) inst113 (.A(Y), .B(inst115_data), .gr(inst113_gr));  // open: ls, eq
  and inst125 (inst125_out, inst118_out, inst121_out);
  and inst158 (inst158_out, inst156_ls, inst154_gr);
  and inst170 (inst170_out, inst174_out, inst166_gr);
  CONSTX #(.size(10), .\const (70)) inst186 (.data(inst186_data));
  CONSTX #(.size(10), .\const (100)) inst233 (.data(inst233_data));
  CMPX #(.size(10)) inst270 (.A(X), .B(inst280_data), .eq(inst270_eq), .gr(inst270_gr));  // open: ls
  CONSTX #(.size(10), .\const (60)) inst115 (.data(inst115_data));
  CMPX #(.size(10)) inst242 (.A(Y), .B(inst243_data), .ls(inst242_ls));  // open: eq, gr
  CONSTX #(.size(10), .\const (680)) inst280 (.data(inst280_data));
  or inst273 (inst273_out, inst270_gr, inst270_eq);
  and inst117 (inst117_out, inst114_ls, inst113_gr);
  CMPX #(.size(10)) inst156 (.A(Y), .B(inst157_data), .ls(inst156_ls));  // open: eq, gr
  CMPX #(.size(10)) inst168 (.A(Y), .B(inst169_data), .ls(inst168_ls), .eq(inst168_eq));  // open: gr
  or inst174 (inst174_out, inst168_ls, inst168_eq);
  CONSTX #(.size(10), .\const (100)) inst243 (.data(inst243_data));
  CMPX #(.size(10)) inst114 (.A(Y), .B(inst116_data), .ls(inst114_ls));  // open: eq, gr
  CONSTX #(.size(10), .\const (40)) inst157 (.data(inst157_data));
  CONSTX #(.size(10), .\const (80)) inst169 (.data(inst169_data));
  and inst272 (inst272_out, inst271_ls, inst273_out);
  CONSTX #(.size(10), .\const (80)) inst116 (.data(inst116_data));
  CMPX #(.size(10)) inst271 (.A(X), .B(inst281_data), .ls(inst271_ls));  // open: eq, gr
  CONSTX #(.size(10), .\const (760)) inst281 (.data(inst281_data));
  CMPX #(.size(10)) inst248 (.A(X), .B(inst257_data), .gr(inst248_gr));  // open: ls, eq
  and inst279 (inst279_out, inst272_out, inst278_out);
  or inst282 (bela8, inst292_out, inst311_out, inst279_out);
  CONSTX #(.size(10), .\const (580)) inst257 (.data(inst257_data));
  CMPX #(.size(10)) inst274 (.A(Y), .B(inst275_data), .gr(inst274_gr));  // open: ls, eq
  and inst250 (inst250_out, inst249_ls, inst248_gr);
  CONSTX #(.size(10), .\const (80)) inst275 (.data(inst275_data));
  CMPX #(.size(10)) inst249 (.A(X), .B(inst258_data), .ls(inst249_ls));  // open: eq, gr
  and inst278 (inst278_out, inst276_ls, inst274_gr);
  CONSTX #(.size(10), .\const (600)) inst258 (.data(inst258_data));
  CMPX #(.size(10)) inst276 (.A(Y), .B(inst277_data), .ls(inst276_ls));  // open: eq, gr
  CONSTX #(.size(10), .\const (100)) inst277 (.data(inst277_data));
  and inst255 (inst255_out, inst250_out, inst254_out);
  CMPX #(.size(10)) inst251 (.A(Y), .B(inst256_data), .gr(inst251_gr));  // open: ls, eq
  CONSTX #(.size(16), .\const (760)) inst297 (.data(inst297_data));
  CONSTX #(.size(10), .\const (20)) inst256 (.data(inst256_data));
  sub inst293 (.a(inst297_data), .b({{6{1'b0}}, Y}), .rez(inst293_rez));
  CMPX #(.size(16)) inst298 (.A({{6{1'b0}}, X}), .B(inst293_rez), .eq(inst298_eq), .gr(inst298_gr));  // open: ls
  and inst254 (inst254_out, inst252_ls, inst251_gr);
  or inst299 (inst299_out, inst298_gr, inst298_eq);
  CMPX #(.size(10)) inst252 (.A(Y), .B(inst253_data), .ls(inst252_ls));  // open: eq, gr
  CONSTX #(.size(10), .\const (100)) inst253 (.data(inst253_data));
  CONSTX #(.size(16), .\const (800)) inst300 (.data(inst300_data));
  and inst311 (inst311_out, inst302_out, inst310_out, inst299_out);
  sub inst296 (.a(inst300_data), .b({{6{1'b0}}, Y}), .rez(inst296_rez));
  CMPX #(.size(16)) inst301 (.A({{6{1'b0}}, X}), .B(inst296_rez), .ls(inst301_ls), .eq(inst301_eq));  // open: gr
  or inst302 (inst302_out, inst301_eq, inst301_ls);
  CMPX #(.size(10)) inst304 (.A(Y), .B(inst306_data), .eq(inst304_eq), .gr(inst304_gr));  // open: ls
  CMPX #(.size(10)) inst305 (.A(Y), .B(inst307_data), .ls(inst305_ls), .eq(inst305_eq));  // open: gr
  CONSTX #(.size(10), .\const (40)) inst306 (.data(inst306_data));
  CONSTX #(.size(10), .\const (80)) inst307 (.data(inst307_data));
  or inst309 (inst309_out, inst305_eq, inst305_ls);
  or inst308 (inst308_out, inst304_gr, inst304_eq);
  and inst310 (inst310_out, inst309_out, inst308_out);

  assign valid = 1'b1;
endmodule
